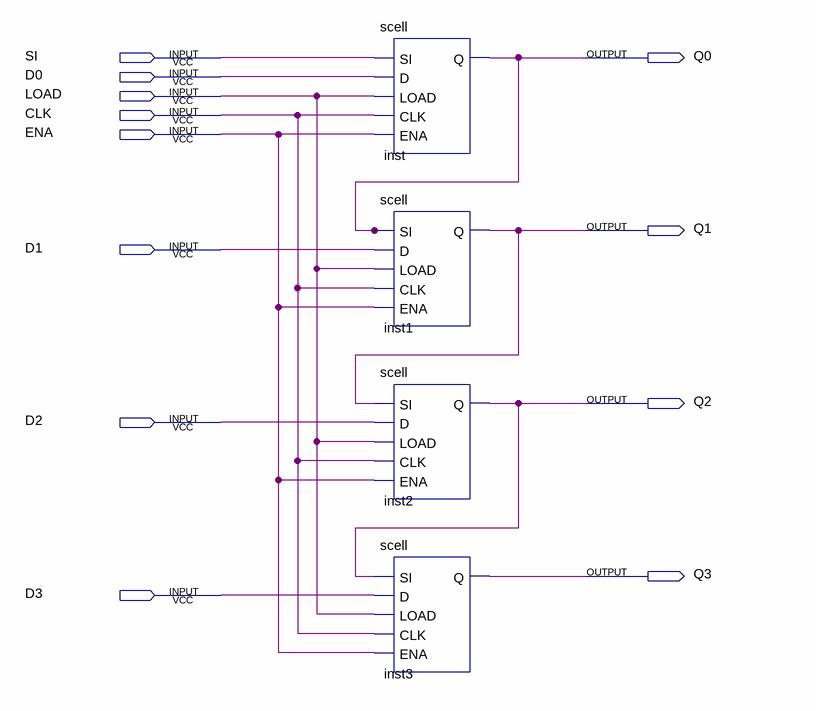
[diagram p0: schematic sheet]
// Quartus schematic test595.bdf as structural Verilog: 4 symbols, 12 pins
module test595 (
  input  SI,
  input  D0,
  input  LOAD,
  input  CLK,
  input  ENA,
  input  D1,
  input  D2,
  input  D3,
  output Q0,
  output Q1,
  output Q2,
  output Q3
);

  scell inst (.SI(SI), .D(D0), .LOAD(LOAD), .CLK(CLK), .ENA(ENA), .Q(Q0));
  scell inst1 (.SI(Q0), .D(D1), .LOAD(LOAD), .CLK(CLK), .ENA(ENA), .Q(Q1));
  scell inst2 (.SI(Q1), .D(D2), .LOAD(LOAD), .CLK(CLK), .ENA(ENA), .Q(Q2));
  scell inst3 (.SI(Q2), .D(D3), .LOAD(LOAD), .CLK(CLK), .ENA(ENA), .Q(Q3));
endmodule
